# EAGLE design irma_nano (EAGLE 8.3.2)
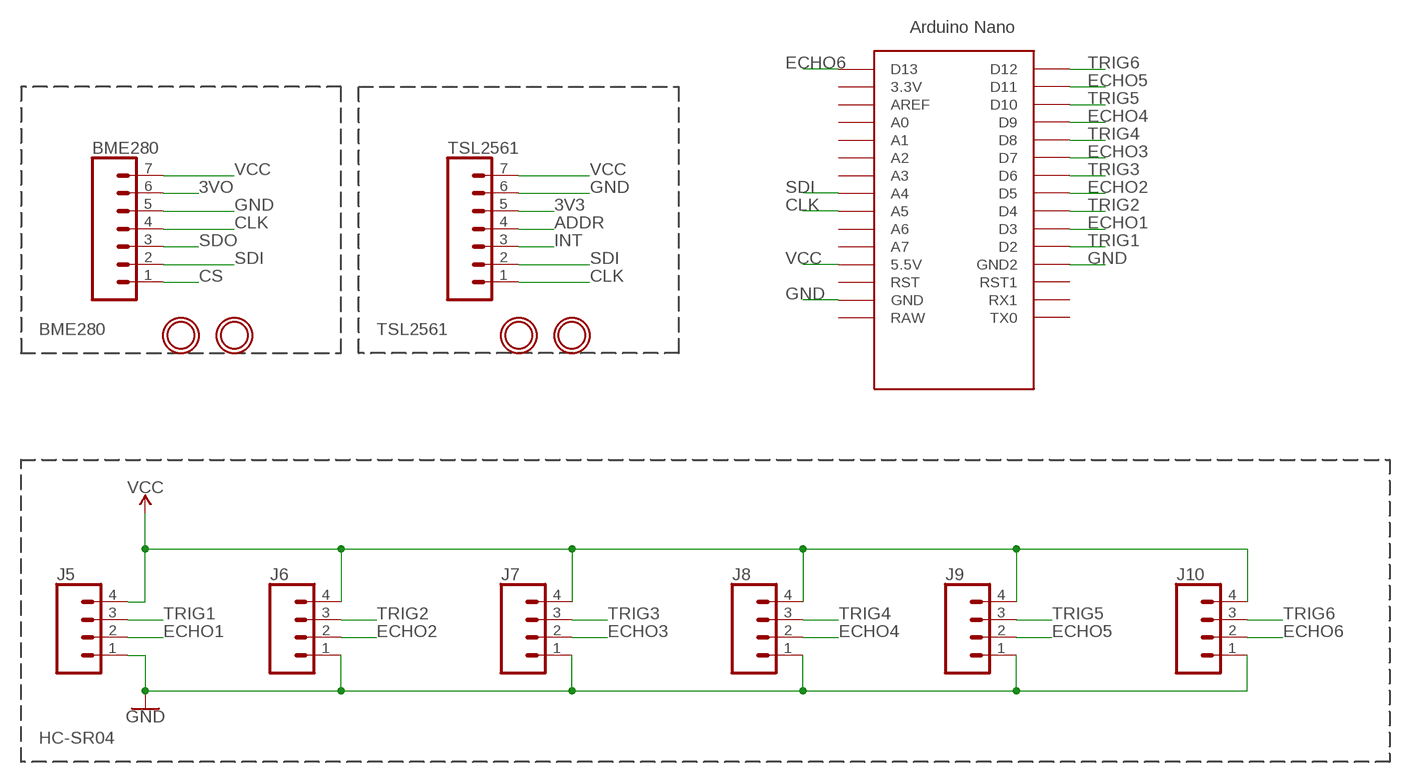
[diagram p0: schematic, sheet 1]

## Parts
BME280  CONN_07  [1X07]
J5  CONN_04  [1X04]
J6  CONN_04  [1X04]
J7  CONN_04  [1X04]
J8  CONN_04  [1X04]
J9  CONN_04  [1X04]
J10  CONN_04  [1X04]
TSL2561  CONN_07  [1X07]
U$1  MOUNTINGHOLE2.0  [MOUNTINGHOLE_2.0_PLATED]
U$2  MOUNTINGHOLE2.0  [MOUNTINGHOLE_2.0_PLATED]
U$3  MOUNTINGHOLE2.5  [MOUNTINGHOLE_2.5_PLATED]
U$4  MOUNTINGHOLE2.5  [MOUNTINGHOLE_2.5_PLATED]
U$5  NANO  [NANO]

## Nets
3V3: TSL2561.5
3VO: BME280.6
ADDR: TSL2561.4
CLK: BME280.4 TSL2561.1 U$5.A5
CS: BME280.1
ECHO1: J5.2 U$5.D3
ECHO2: J6.2 U$5.D5
ECHO3: J7.2 U$5.D7
ECHO4: J8.2 U$5.D9
ECHO5: J9.2 U$5.D11
ECHO6: J10.2 U$5.D13
GND: BME280.5 J5.1 J6.1 J7.1 J8.1 J9.1 J10.1 TSL2561.6 U$5.GND U$5.GND1(GND2)
INT: TSL2561.3
SDI: BME280.2 TSL2561.2 U$5.A4
SDO: BME280.3
TRIG1: J5.3 U$5.D2
TRIG2: J6.3 U$5.D4
TRIG3: J7.3 U$5.D6
TRIG4: J8.3 U$5.D8
TRIG5: J9.3 U$5.D10
TRIG6: J10.3 U$5.D12
VCC: BME280.7 J5.4 J6.4 J7.4 J8.4 J9.4 J10.4 TSL2561.7 U$5.5V(5.5V)
Unconnected: U$5.3.3V U$5.A0 U$5.A1 U$5.A2 U$5.A3 U$5.A6 U$5.A7 U$5.AREF U$5.ICSP1 U$5.ICSP2 U$5.ICSP3 U$5.ICSP4 U$5.ICSP5 U$5.ICSP6 U$5.RAW U$5.RST U$5.RST1 U$5.RX1 U$5.TX0

## Notes on the sheet
- BME280 | TSL2561
- HC-SR04

## Library data of the parts
BME280 TSL2561 = SparkFun-Connectors:CONN_07: Multi connection point. Often used as Generic Header-pin footprint for 0.1 inch spaced/style header connections On any of the 0.1 inch spaced packages, you can populate with these: Break Away Headers - Straight <https://www.sparkfun.com/products/116> (PRT-00116) Break Away Male Headers - Right Angle <https://www.sparkfun.com/products/553> (PRT-00553) Female Headers <https://www.sparkfun.com/products/115> (PRT-00115) Break Away Headers - Machine Pin <https://www.sparkfun.com/products/117> (PRT-00117) Break Away Female Headers - Swiss Machine Pin <https://www.sparkfun.com/products/743> (PRT-00743) For SCREWTERMINALS and SPRING TERMINALS visit here: Screw Terimnals on SparkFun.com <https://www.sparkfun.com/search/results?term=Screw+Terminals> (5mm/3.5mm/2.54mm spacing) This device is also useful as a general connection point to wire up your design to another part of your project. Our various solder wires solder well into these plated through hole pads. Hook-Up Wire - Assortment (Stranded, 22 AWG) <https://www.sparkfun.com/products/11375> (PRT-11375) Hook-Up Wire - Assortment (Solid Core, 22 AWG) <https://www.sparkfun.com/products/11367> (PRT-11367) View the entire wire category on our website here <https://www.sparkfun.com/categories/141> Special notes: Molex polarized connector foot print use with SKU : PRT-08231 with associated crimp pins and housings. 1MM SMD Version SKU: PRT-10208 NOTES ON THE VARIANTS LOCK and LOCK_LONGPADS... This footprint was designed to help hold the alignment of a through-hole component (i.e. 6-pin header) while soldering it into place. You may notice that each hole has been shifted either up or down by 0.005 of an inch from it's more standard position (which is a perfectly straight line). This slight alteration caused the pins (the squares in the middle) to touch the edges of the holes. Because they are alternating, it causes a "brace" to hold the component in place. 0.005 has proven to be the perfect amount of "off-center" position when using our standard breakaway headers. Although looks a little odd when you look at the bare footprint, once you have a header in there, the alteration is very hard to notice. Also,if you push a header all the way into place, it is covered up entirely on the bottom side.
J5-J10 = SparkFun-Connectors:CONN_04: Multi connection point. Often used as Generic Header-pin footprint for 0.1 inch spaced/style header connections On any of the 0.1 inch spaced packages, you can populate with these: Break Away Headers - Straight <https://www.sparkfun.com/products/116> (PRT-00116) Break Away Male Headers - Right Angle <https://www.sparkfun.com/products/553> (PRT-00553) Female Headers <https://www.sparkfun.com/products/115> (PRT-00115) Break Away Headers - Machine Pin <https://www.sparkfun.com/products/117> (PRT-00117) Break Away Female Headers - Swiss Machine Pin <https://www.sparkfun.com/products/743> (PRT-00743) For SCREWTERMINALS and SPRING TERMINALS visit here: Screw Terimnals on SparkFun.com <https://www.sparkfun.com/search/results?term=Screw+Terminals> (5mm/3.5mm/2.54mm spacing) This device is also useful as a general connection point to wire up your design to another part of your project. Our various solder wires solder well into these plated through hole pads. Hook-Up Wire - Assortment (Stranded, 22 AWG) <https://www.sparkfun.com/products/11375> (PRT-11375) Hook-Up Wire - Assortment (Solid Core, 22 AWG) <https://www.sparkfun.com/products/11367> (PRT-11367) View the entire wire category on our website here <https://www.sparkfun.com/categories/141> Special notes: Molex polarized connector foot print use with SKU : PRT-08231 with associated crimp pins and housings. 1MM SMD Version SKU: PRT-10208; PROD_ID: CONN-09696
U$1-U$4 = microbuilder:MOUNTINGHOLE: Mounting Hole For #2 screws (0.086"/2.18mm width, 0.094"/2.4mm hole) use 2.5mm
U$5 = Arduino-clone:NANO: Arduino Nano

## Board
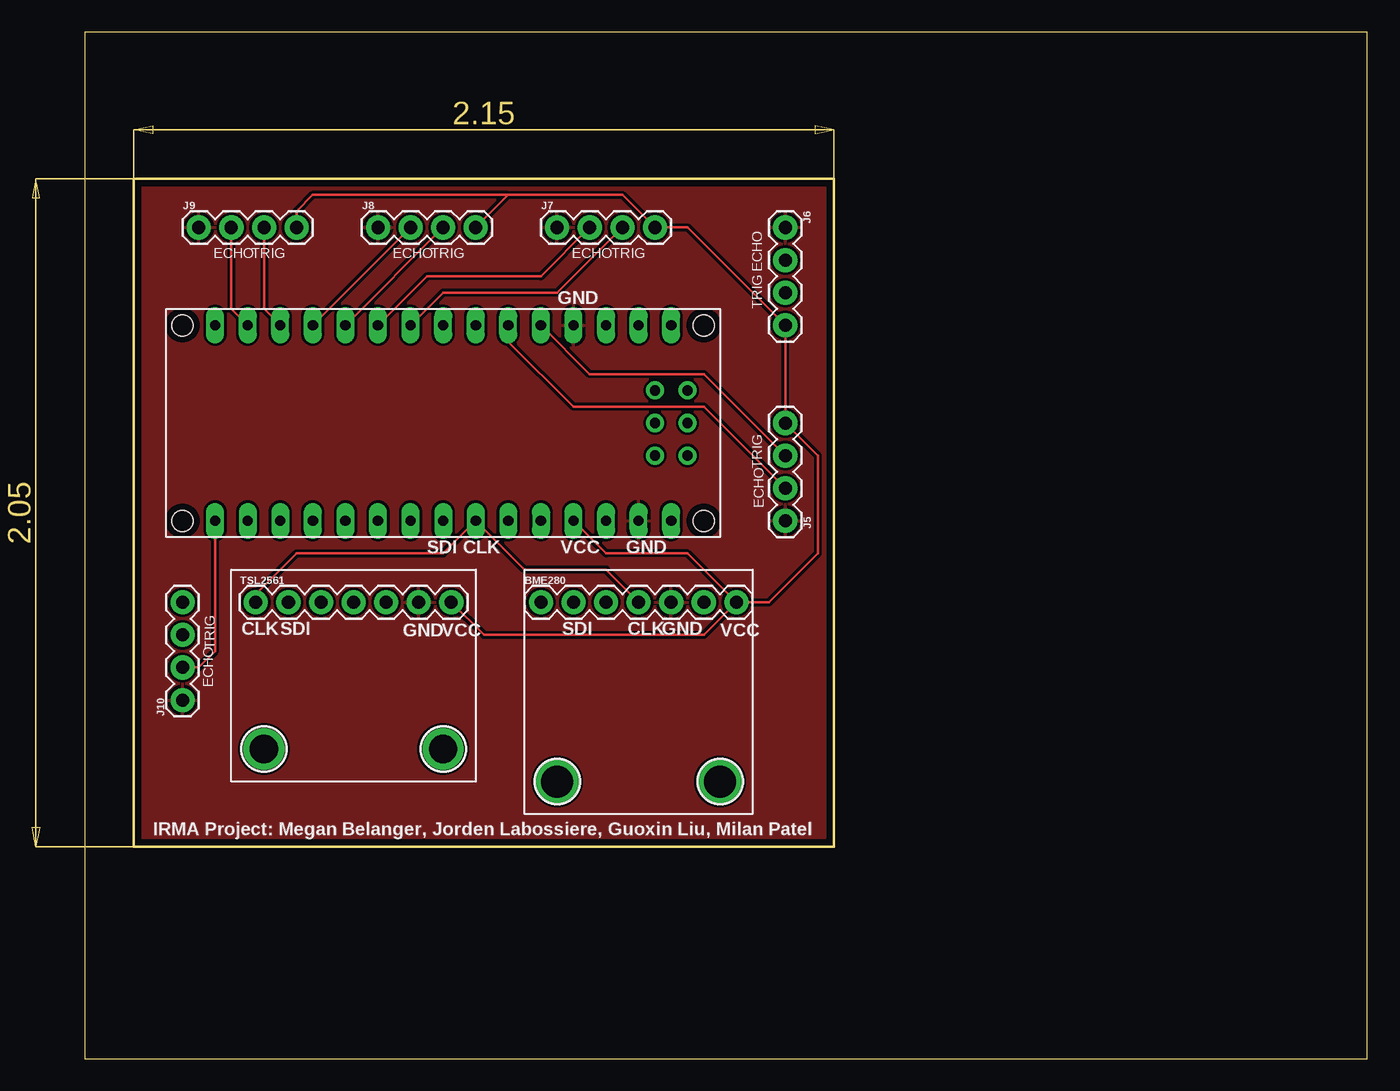
[diagram p1: board, top side]
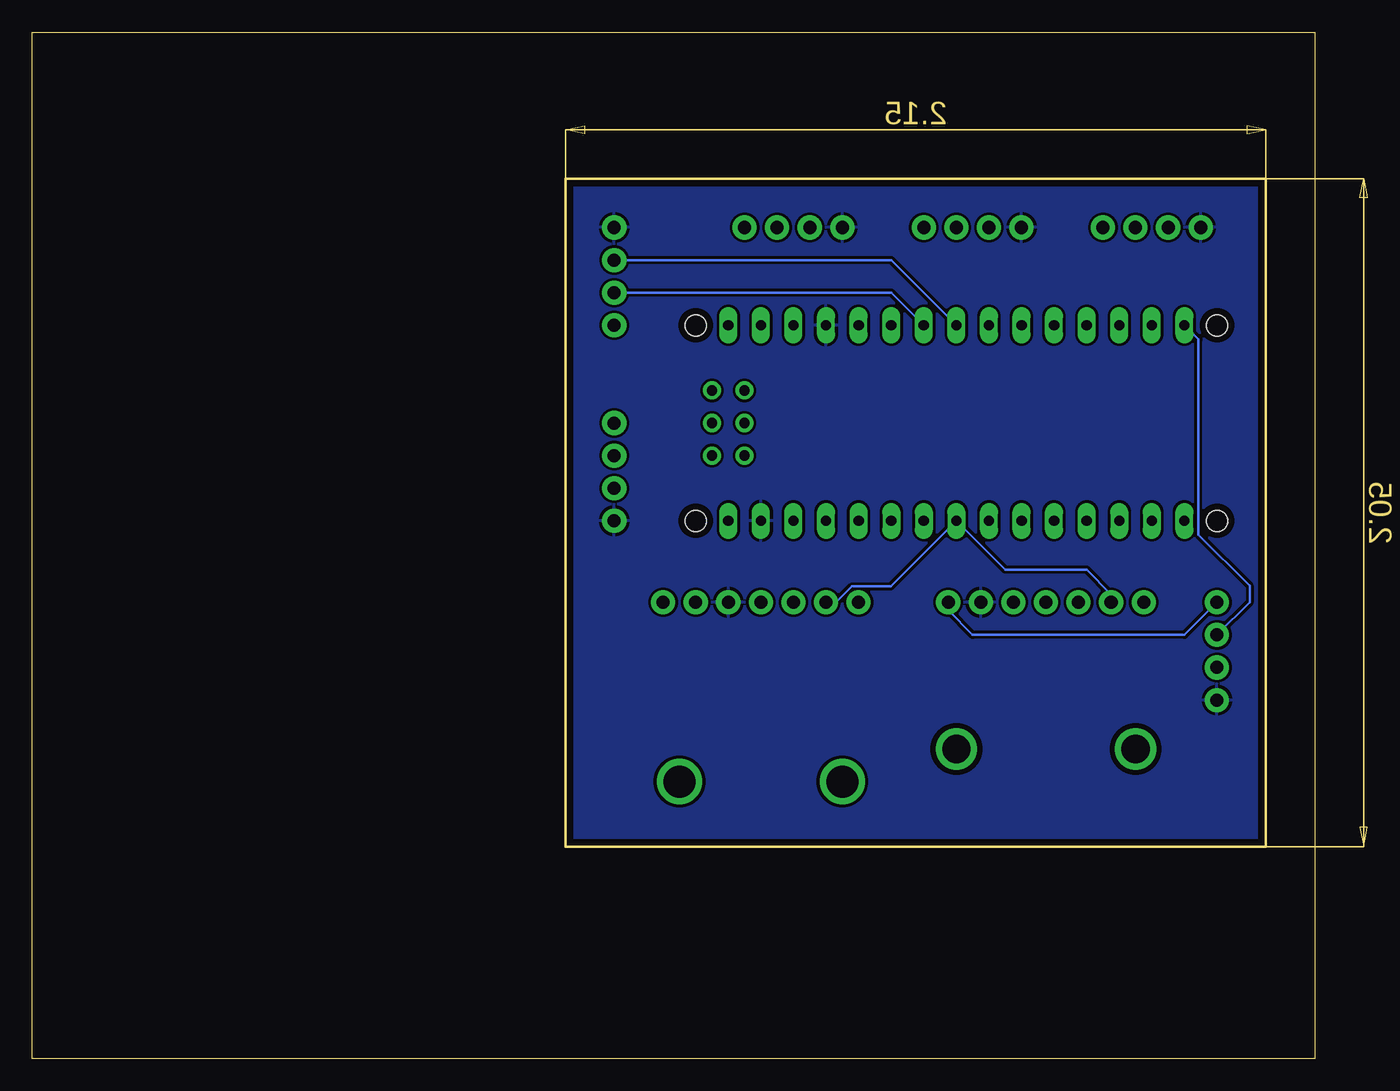
[diagram p2: board, bottom side, seen from below]

Size 100 x 80 mm. Coordinates in mm from the lower left corner, seen from the top.
Outline: 0,0 100,0 100,80 0,80 0,0
Outline: 3.81,68.58 58.42,68.58 58.42,16.51 3.81,16.51 3.81,68.58
Copper layers (1*16): Top 0.035mm / dielectric 1.5mm / Bottom 0.035mm
Design rules "sparfun-modified-design-rules": minimum track width 8mil, minimum drill 15mil, track to track 8mil, track to pad 8mil, pad to pad 8mil, via to via 8mil, smd to smd 8mil, copper to edge 20mil, drill to drill 15mil, minimum pad ring 12mil, minimum via ring 10mil, stop-mask expansion 4mil, vias tented up to drill 25mil, thermal gap 10mil
Holes 1.65 mm at 7.62,57.15 7.62,41.91 48.26,41.91 48.26,57.15

### Footprints (pad centres in the part's own frame; a part is rotated, then mirrored left to right if it is on the bottom)
1X07 = drill 1.016 pad 1.88: 1 0,0; 2 2.54,0; 3 5.08,0; 4 7.62,0; 5 10.16,0; 6 12.7,0; 7 15.24,0
1X04 = drill 1.016 pad 1.88: 1 0,0; 2 2.54,0; 3 5.08,0; 4 7.62,0
MOUNTINGHOLE_2.0_PLATED = drill 2.2 pad 3: P$1 0,0
MOUNTINGHOLE_2.5_PLATED = drill 2.5 pad 3.2: P$1 0,0
NANO = drill 0.8 long: 3.3V -10.16,24.13; 5V -10.16,-1.27; A0 -10.16,19.05; A1 -10.16,16.51; A2 -10.16,13.97; A3 -10.16,11.43; A4 -10.16,8.89; A5 -10.16,6.35; A6 -10.16,3.81; A7 -10.16,1.27; AREF -10.16,21.59; D2 5.08,1.27; D3 5.08,3.81; D4 5.08,6.35; D5 5.08,8.89; D6 5.08,11.43; D7 5.08,13.97; D8 5.08,16.51; D9 5.08,19.05; D10 5.08,21.59; D11 5.08,24.13; D12 5.08,26.67; D13 -10.16,26.67; GND -10.16,-6.35; GND1 5.08,-1.27; RAW -10.16,-8.89; RST -10.16,-3.81; RST1 5.08,-3.81; RX1 5.08,-6.35; TX0 5.08,-8.89 | drill 0.8: ICSP1 -5.08,-10.16; ICSP2 -5.08,-7.62; ICSP3 -2.54,-10.16; ICSP4 -2.54,-7.62; ICSP5 0,-10.16; ICSP6 0,-7.62

### Placement (x,y rotation side)
BME280  35.56,35.56 0 top
J5  54.61,41.91 90 top
J6  54.61,64.77 270 top
J7  36.83,64.77 0 top
J8  22.86,64.77 0 top
J9  8.89,64.77 0 top
J10  7.62,27.94 90 top
TSL2561  13.34,35.56 0 top
U$1  13.97,24.13 0 top
U$2  27.94,24.13 0 top
U$3  36.83,21.59 0 top
U$4  49.53,21.59 0 top
U$5  36.83,52.07 90 top

### Tracks (layer width: path | path; a pad name or v marks a point on that pad's centre or on a via)
CLK
  Top 0.203: TSL2561.1 13.34,36.2 16.51,39.37 27.94,39.37 U$5.A5 34.29,38.1 40.64,38.1 BME280.4
ECHO1
  Top 0.203: J5.2 48.26,50.8 38.1,50.8 33.02,55.88 U$5.D3
ECHO2
  Bottom 0.203: J6.2 33.02,62.23 U$5.D5
ECHO3
  Top 0.203: J7.2 35.56,60.96 26.67,60.96 U$5.D7
ECHO4
  Top 0.203: J8.2 U$5.D9
ECHO5
  Top 0.203: J9.2 11.43,58.42 U$5.D11
ECHO6
  Top 0.203: J10.2 8.89,30.48 10.16,31.75 U$5.D13
GND
  pour Top: 3.81,16.51 3.81,68.58 58.42,68.58 58.42,16.51
  pour Bottom: 3.81,16.51 3.81,68.58 58.42,68.58 58.42,16.51
SDI
  Bottom 0.203: TSL2561.2 15.88,36.2 17.78,38.1 24.13,38.1 U$5.A4 33.05,36.8 36.08,36.8 37.32,35.56 BME280.2
TRIG1
  Top 0.203: J5.3 48.26,53.34 39.37,53.34 U$5.D2
TRIG2
  Bottom 0.203: J6.3 33.02,59.69 U$5.D4
TRIG3
  Top 0.203: J7.3 36.83,59.69 27.94,59.69 U$5.D6
TRIG4
  Top 0.203: J8.3 U$5.D8
TRIG5
  Top 0.203: J9.3 13.97,58.42 U$5.D10
TRIG6
  Bottom 0.203: U$5.D12 9.05,56.05 9.05,41.91 | 9.05,41.32 9.05,41.91 | 9.05,41.91 9.05,40.8 5.08,36.83 5.08,35.56 J10.3
VCC
  Top 0.203: BME280.7 46.99,39.37 40.64,39.37 U$5.5V | TSL2561.7 31.11,33.02 48.26,33.02 BME280.7 | BME280.7 53.34,35.56 57.15,39.37 57.15,46.99 J5.4 J6.4 46.99,64.77 J7.4 41.91,67.31 33.02,67.31 | J9.4 16.51,66.04 17.78,67.31 33.02,67.31 | J8.4 33.02,67.31
  Bottom 0.203: J10.4 10.16,33.02 26.67,33.02 28.57,34.92 TSL2561.7

### Text on the board
tPlace: ECHO | TRIG | ECHO | TRIG | ECHO | TRIG | ECHO | GND | TRIG | TRIG | ECHO | SDI | CLK | VCC | GND | CLK | SDI | GND | VCC | SDI | CLK | GND | VCC | TRIG | ECHO | IRMA Project: Megan Belanger, Jorden Labossiere, Guoxin Liu, Milan Patel